# Altium schematic sheet MCU.SchDoc
size A4; SheetNumber: 1; SheetTotal: 7
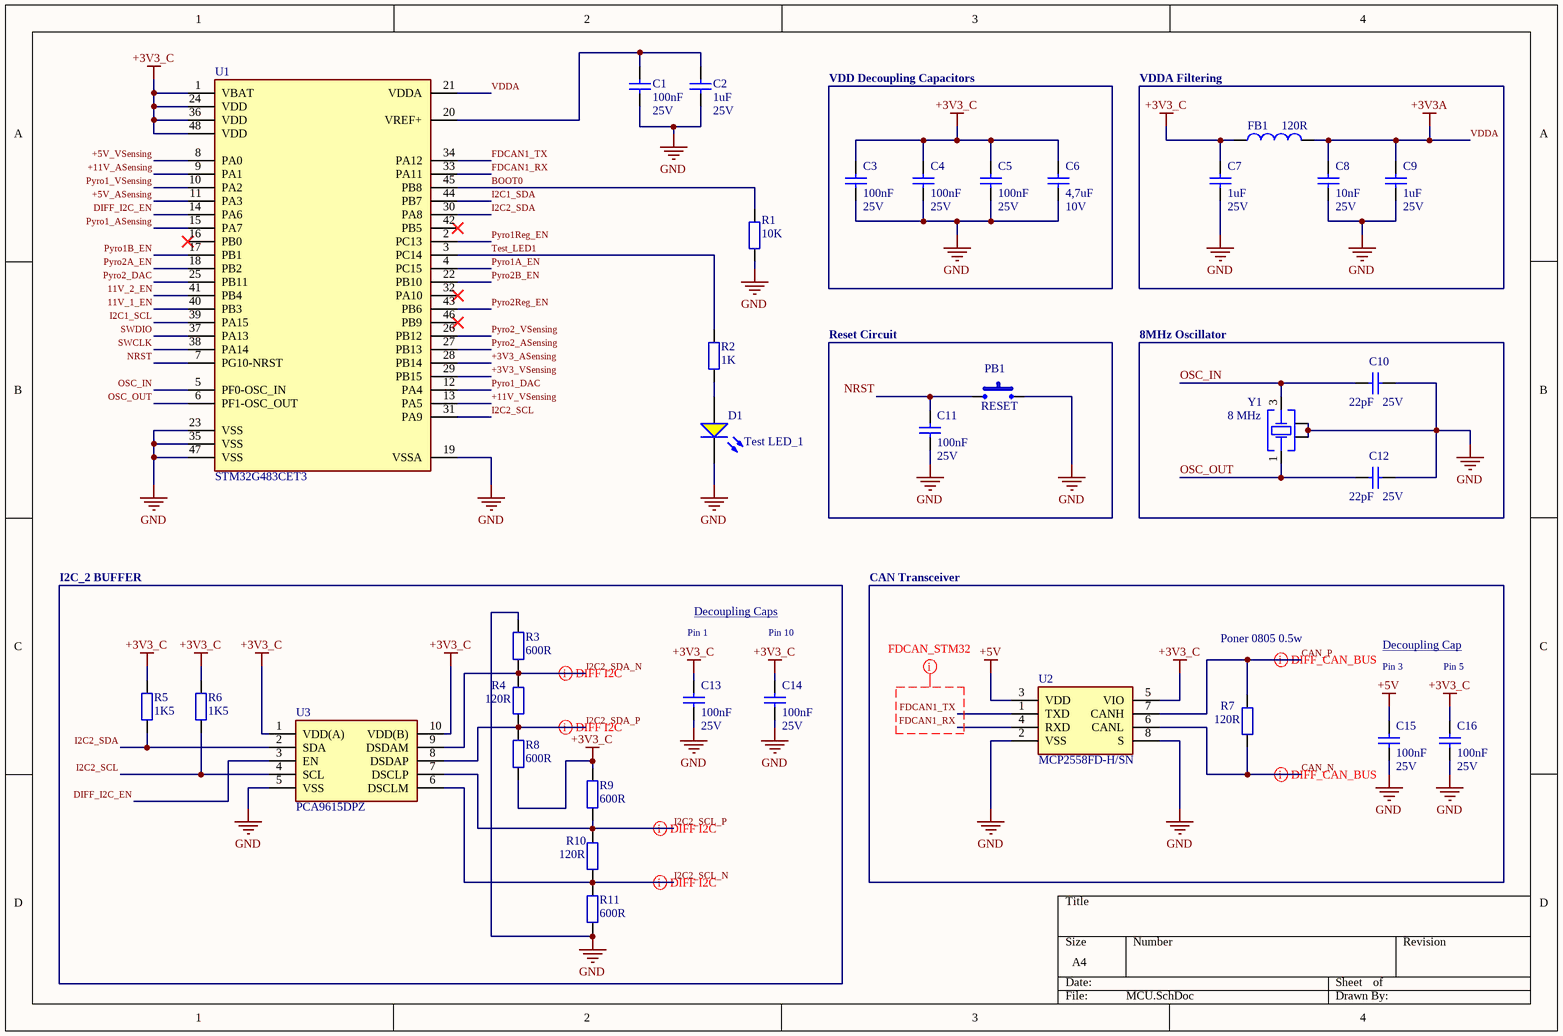
[diagram p0: MCU.SchDoc]

## Parts
C1  value 100nF  Voltage: 25V  [MY_0603]  (hidden comment: Cap ceramic)
C2  value 1uF  Volte: 25V  [MY_0603]  (hidden comment: Cap ceramic)
C3  value 100nF  Voltage: 25V  [MY_0603]  (hidden comment: Cap ceramic)
C4  value 100nF  Voltage: 25V  [MY_0603]  (hidden comment: Cap ceramic)
C5  value 100nF  Voltage: 25V  [MY_0603]  (hidden comment: Cap ceramic)
C6  value 4,7uF  Volte: 10V  [MY_0603]  (hidden comment: Cap ceramic)
C7  value 1uF  Volte: 25V  [MY_0603]  (hidden comment: Cap ceramic)
C8  25V  value 10nF  [MY_0603]
C9  value 1uF  Volte: 25V  [MY_0603]  (hidden comment: Cap ceramic)
C10  value 22pF  Volte: 25V  [MY_0603]  (hidden comment: Cap ceramic)
C11  value 100nF  Voltage: 25V  [MY_0603]  (hidden comment: Cap ceramic)
C12  value 22pF  Volte: 25V  [MY_0603]  (hidden comment: Cap ceramic)
C13  value 100nF  Voltage: 25V  [MY_0603]  (hidden comment: Cap ceramic)
C14  value 100nF  Voltage: 25V  [MY_0603]  (hidden comment: Cap ceramic)
C15  value 100nF  Voltage: 25V  [MY_0603]  (hidden comment: Cap ceramic)
C16  value 100nF  Voltage: 25V  [MY_0603]  (hidden comment: Cap ceramic)
D1  Test LED_1  [WL-SMCW_0805_150080xx75000]
FB1  120R  [WE-CBF_0603_L1.6W0.8H0.8_HC]
PB1  RESET  [Push Button-Footprint-1]
R1  10K  [R0603-0.45]
R2  1K  [R0603-0.45]
R3  600R  [R0805-0.45]
R4  120R  [R0805-0.45]
R5  1K5  [R0603-0.45]
R6  1K5  [R0603-0.45]
R7  120R  [R0805-0.45]
R8  600R  [R0805-0.45]
R9  600R  [R0805-0.45]
R10  120R  [R0805-0.45]
R11  600R  [R0805-0.45]
U1  STM32G483CET3  [STM32G0C1RET6-Footprint-1]
U2  MCP2558FD-H/SN  [MCP2557FD-H_SN-Footprint-1]
U3  PCA9615DPZ  [PCA9615DPZ-Footprint-1]
Y1  8 MHz  [WE-XTAL_CFPX-104]

## Blocks framed on the sheet
VDD Decoupling Capacitors: C3-C6
VDDA Filtering: C7-C9 FB1
Reset Circuit: C11 PB1
8MHz Oscillator: C10 C12 Y1

## Nets
+3V3_C: C3.2 C4.2 C5.2 C6.2 C7.2 C13.2 C14.2 C16.2 FB1.1 R5.1 R6.1 R8.2 R9.1 U1.1(VBAT) U1.24(VDD) U1.36(VDD) U1.48(VDD) U2.5(VIO) U3.1(VDD(A)) U3.10(VDD(B))
+5V: C15.2 U2.3(VDD)
GND: C1.1 C2.1 C3.1 C4.1 C5.1 C6.1 C7.1 C8.1 C9.1 C10.2 C11.1 C12.2 C13.1 C14.1 C15.1 C16.1 D1.1(K) PB1.2 R1.2 R3.1 R11.2 U1.19(VSSA) U1.23(VSS) U1.35(VSS) U1.47(VSS) U2.2(VSS) U2.8(S) U3.5(VSS) Y1.2(GND_&_Lid) Y1.4(GND_&_Lid)
VDDA: C8.2 C9.2 FB1.2 U1.21(VDDA)  [also labelled +3V3A]
11V_1_EN: U1.40(PB3)
11V_2_EN: U1.41(PB4)
+3V3_ASensing: U1.28(PB14)
+3V3_VSensing: U1.29(PB15)
+5V_ASensing: U1.11(PA3)
+5V_VSensing: U1.8(PA0)
+11V_ASensing: U1.9(PA1)
+11V_VSensing: U1.13(PA5)
BOOT0: R1.1 U1.45(PB8)
CAN_N: R7.1 U2.6(CANL)
CAN_P: R7.2 U2.7(CANH)
DIFF_I2C_EN: U1.14(PA6) U3.3(EN)
FDCAN1_RX: U1.33(PA11) U2.4(RXD)
FDCAN1_TX: U1.34(PA12) U2.1(TXD)
I2C1_SCL: U1.39(PA15)
I2C1_SDA: U1.44(PB7)
I2C2_SCL: R6.2 U1.31(PA9) U3.4(SCL)
I2C2_SCL_N: R10.1 R11.1 U3.6(DSCLM)
I2C2_SCL_P: R9.2 R10.2 U3.7(DSCLP)
I2C2_SDA: R5.2 U1.30(PA8) U3.2(SDA)
I2C2_SDA_N: R3.2 R4.2 U3.9(DSDAM)
I2C2_SDA_P: R4.1 R8.1 U3.8(DSDAP)
NRST: C11.2 PB1.1 U1.7(PG10-NRST)
OSC_IN: C10.1 U1.5(PF0-OSC_IN) Y1.3(Crystal)
OSC_OUT: C12.1 U1.6(PF1-OSC_OUT) Y1.1(Crystal)
Pyro1_ASensing: U1.15(PA7)
Pyro1_DAC: U1.12(PA4)
Pyro1_VSensing: U1.10(PA2)
Pyro1A_EN: U1.4(PC15)
Pyro1B_EN: U1.17(PB1)
Pyro1Reg_EN: U1.2(PC13)
Pyro2_ASensing: U1.27(PB13)
Pyro2_DAC: U1.25(PB11)
Pyro2_VSensing: U1.26(PB12)
Pyro2A_EN: U1.18(PB2)
Pyro2B_EN: U1.22(PB10)
Pyro2Reg_EN: U1.43(PB6)
SWCLK: U1.38(PA14)
SWDIO: U1.37(PA13)
Test_LED1: R2.2 U1.3(PC14)
NetC1_2: C1.2 C2.2 U1.20(VREF+)
NetD1_2: D1.2(A) R2.1

Not connected (* = marked no-connect by the designer): U1 16(PB0)* 32(PA10)* 42(PB5)* 46(PB9)*

## Layout directives
differential pair; differential pair class I2C: I2C2_SCL_N, I2C2_SCL_P, I2C2_SDA_N, I2C2_SDA_P
net class FDCAN_STM32: FDCAN1_RX, FDCAN1_TX
differential pair; differential pair class CAN_BUS: CAN_N, CAN_P

## Notes on the sheet
- I2C_2 BUFFER
- CAN Transceiver
- Pin 1
- Decoupling Caps
- Pin 10
- Poner 0805 0.5w
- Decoupling Cap
- Pin 3
- Pin 5

## Library data of the parts
C1 C3-C5 C11 C13-C16 = CMP-015-000000-1: Capacitor, 100nF, 0603, 25V; Manufacturer: Wurth Elektronik; Manufacturer Part Number: 885012206071
C2 C7 C9 = CMP-015-000000-1: Capacitor, 1uF, 0603, 25V; Manufacturer: Wurth Elektronik; Manufacturer Part Number: 885012206052
C6 = CMP-015-000000-1: Capacitor, 4.7uF, 0603, 25V; Manufacturer: Wurth Elektronik; Manufacturer Part Number: 885012106012
C8 = CMP-015-000000-1: Capacitor, 10nF, 0603, 25V; Manufacturer: Wurth Elektronik; Manufacturer Part Number: 885012206065
C10 C12 = CMP-015-000000-1: Capacitor, 22pF, 0603, 25V; Manufacturer: Wurth Elektronik; Manufacturer Part Number: 885012006034
D1 = CMP-1426-00012-2: LED, 0805, Yellow; NexarPartId: 29717784; Manufacturer: Wurth Elektronik; Manufacturer Part Number: 150080YS75000; Dominant Wavelength: 590nm; Max Reverse Voltage (DC): 5V; Forward Voltage: 2V; Peak Wavelength: 595nm; Max Junction Temperature (Tj): 95°C; Lens Style: Clear, Rectangular; Power Dissipation: 72mW; Test Current: 20mA; Forward Current: 100mA; Luminous Intensity: 120mcd; Viewing Angle: 140°; Min Operating Temperature: -40°C; Case/Package: 0805; REACH SVHC: Unknown; Max Operating Temperature: 85°C; Case Code (Imperial): 0805; Mount: Surface Mount; Packaging: Tape and Reel; RoHS: Compliant; Case Code (Metric): 2012; Reverse Voltage: 5V; Color: Yellow; Height: 700µm; Width: 1.25mm; Wavelength: 590nm; Length: 2mm
FB1 = CMP-0220-00174-3: Ferrite Bead, 120R at 100MHz, 0603, 2 A; Manufacturer: Wurth Elektronik; Manufacturer Part Number: 742792625
PB1 = CMP-010-000001-2: Push Button; Source: IFS_Altium.SchLib; Pin Count: 2; Component Type: Standard; Design Item ID: Push Button
R1 = R: Resistor, 10K, 0603, 0.1W; Manufacturer: Wurth; Manufacturer Part Number: 560112116005; Power Disipation: 0.1W; ClassName: 2PyroREG
R2 = CMP-009-000000-3: Resistor, 1K, 0603, 0.1W; Manufacturer: Wurth; Manufacturer Part Number: 560112116014; Power Disipation: 0.1W
R3 R8 R9 R11 = CMP-009-000000-3: Resistor, 600R, 0805, 0.5W; Manufacturer: Panasonic; Manufacturer Part Number: ERJ-6ENF6040V; Power Disipation: 0.125W
R4 R7 R10 = CMP-009-000000-3: Resistor, 120R, 0805, 0.25W; Manufacturer: Vishay; Manufacturer Part Number: RCS0805120RFKEA; Power Disipation: 0.5W
R5 R6 = CMP-009-000000-3: Resistor, 1.5K, 0603, 0.1W; Manufacturer: Wurth; Manufacturer Part Number: 560112116038; Power Disipation: 0.1W
U1 = CMP-020-00001-5: Microcontroladores ARM (MCU) Mainstream Arm Cortex-M4+ MCU 170MHz 512Kbytes Math Accelerator High Analog; Manufacturer: STMicroelectronics; Manufacturer Part Number: STM32G483CET3
U2 = CMP-00024-00000-3: Interfaz CI CAN CAN FD Transceiver with Silent Mode; Manufacturer: Microchip Technology; Manufacturer Part Number: MCP2558FD-H/SN
U3 = CMP-00024-00001-1: 2 Channel  I2C-busbuffer; Manufacturer: NXP Semiconductors; Manufacturer Part Number: PCA9615DPZ
Y1 = CMP-003-00162-1: WE-XTAL Quartz Crystal, SMT, CFPX-104, 8MHz,; Manufacturer: Wurth Elektronik; Manufacturer Part Number: 830055663; Load Capacitance: 18pF; Length: 5mm; Match Code: WE-XTAL; Frequency: 8MHz; ComponentLink2Description: Datasheet Link; ComponentLink1URL: https://www.we-online.com/redexpert/article/830055663?ad; ComponentLink1Description: Website Link; ComponentLink2URL: https://www.we-online.com/redexpert/spec/830055663?ad